# Altium schematic sheet warship_demo_4.SchDoc
size A4
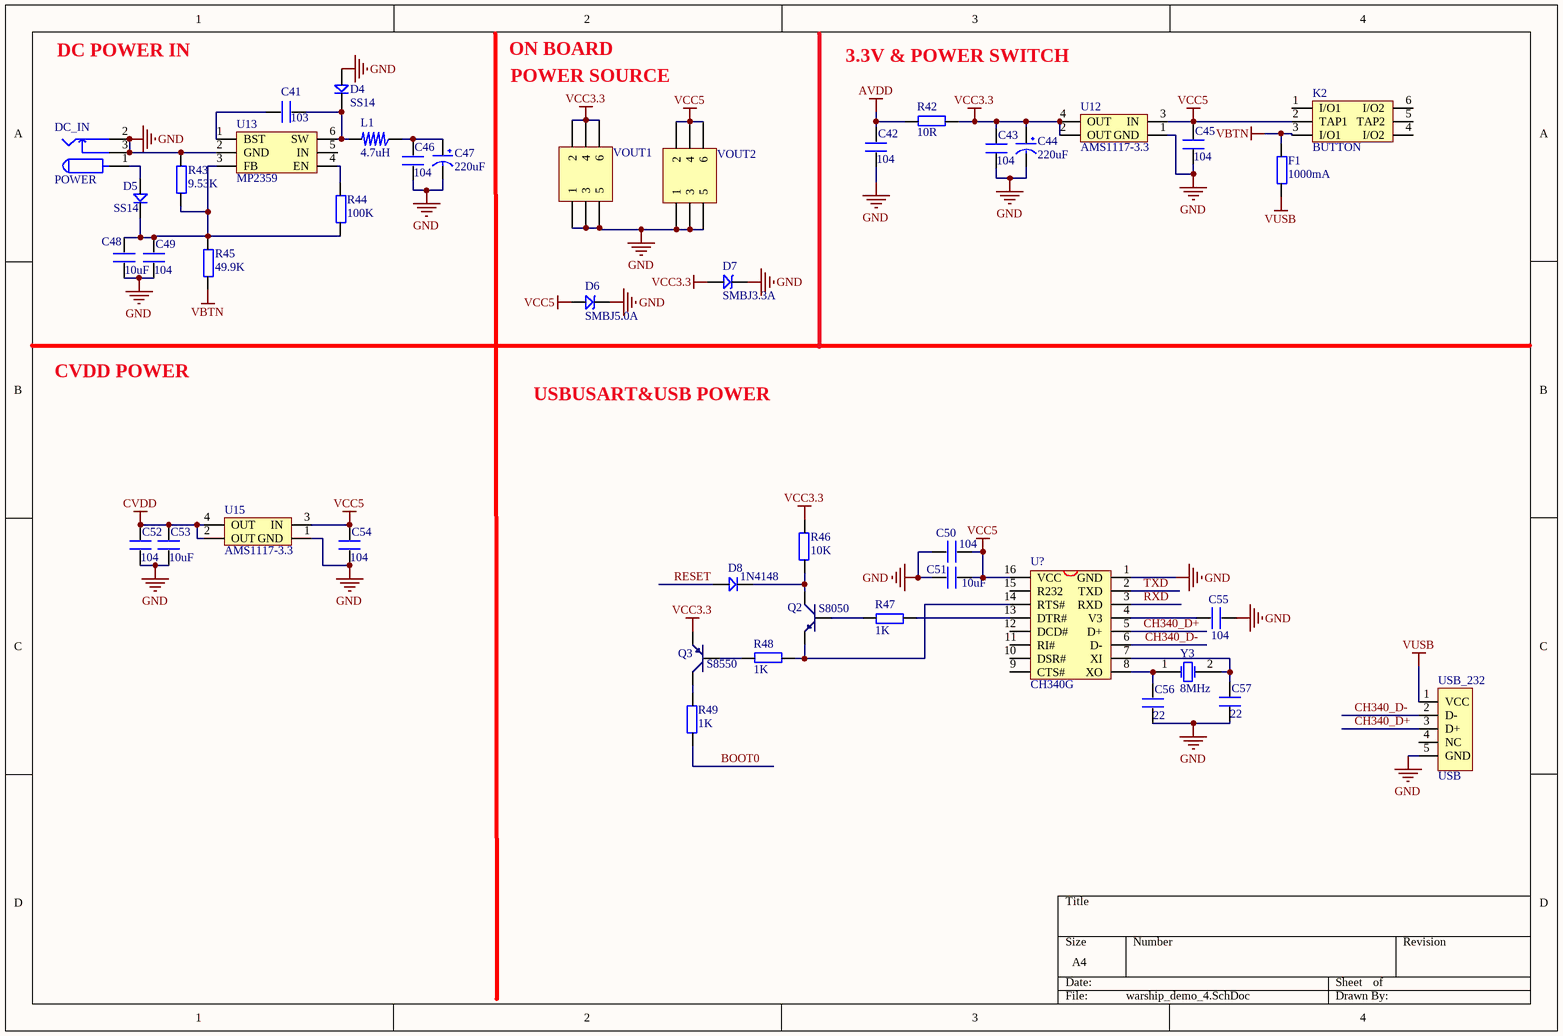
[diagram p0: warship_demo_4.SchDoc]

## Parts
C41  103  [0603P]
C42  104  [0603P]
C43  104  [0603P]
C44  220uF  [CC6.56.5]
C45  104  [0603P]
C46  104  [0603P]
C47  220uF  [CC6.56.5]
C48  10uF  [0603P]
C49  104  [0603P]
C50  104  [0603P]
C51  10uF  [0603P]
C52  104  [0603P]
C53  10uF  [0603P]
C54  104  [0603P]
C55  104  [0603P]
C56  22  [0603P]
C57  22  [0603P]
D4  SS14  [DIODE_SOP]
D5  SS14  [DIODE_SOP]
D6  SMBJ5.0A  [SMBJ]
D7  SMBJ3.3A  [SMBJ]
D8  1N4148  [DIODE_SOP]
DC_IN  POWER  [DC10B]
F1  1000mA  [0603P]
K2  BUTTON  [BTN8.5*8.5]
L1  4.7uH  [L_SOP74]
Q2  S8050  [SOT-23R]
Q3  S8550  [SOT-23R]
R42  10R  [0603P]
R43  9.53K  [0603P]
R44  100K  [0603P]
R45  49.9K  [0603P]
R46  10K  [0603P]
R47  1K  [0603P]
R48  1K  [0603P]
R49  1K  [0603P]
U12  AMS1117-3.3  [AMS1117]
U13  MP2359  [SOT-23-6]
U15  AMS1117-3.3  [AMS1117]
U?  CH340G  [SOP16M]
USB_232  USB  [USB/SM0.8-6H5]
VOUT1  Header 3X2  [HDR2X3]  (value not drawn)
VOUT2  Header 3X2  [HDR2X3]  (value not drawn)
Y3  8MHz  [XTAL_US]

## Nets
AVDD: C42.2 R42.2
CVDD: C52.2 C53.2 U15.2(OUT) U15.4(OUT)
GND: C42.1 C43.1 C44.2(GND) C45.1 C46.1 C47.2(GND) C48.1 C49.1 C50.2 C51.1 C52.1 C53.1 C54.1 C55.1 C56.1 C57.1 D4.1 D6.2 D7.2 DC_IN.2 DC_IN.3 R43.2 U12.1(GND) U13.2(GND) U15.1(GND) U?.1(GND) USB_232.5(GND) VOUT1.1 VOUT1.3 VOUT1.5 VOUT2.1 VOUT2.3 VOUT2.5
VBTN: F1.2 K2.3(I/O1) R45.1
VCC3.3: C43.2 C44.1(VCC) D7.1 Q3.1(E) R42.1 R46.1 U12.2(OUT) U12.4(OUT) VOUT1.2 VOUT1.4 VOUT1.6
VCC5: C45.2 C50.1 C51.2 C54.2 K2.2(TAP1) U12.3(IN) U15.3(IN) U?.16(VCC) VOUT2.2 VOUT2.4 VOUT2.6
VUSB: F1.1 USB_232.1(VCC)
BOOT0: R49.2
CH340_D+: U?.5(D+) USB_232.3(D+)
CH340_D-: U?.6(D-) USB_232.2(D-)
RESET: D8.1
RXD: U?.3(RXD)
TXD: U?.2(TXD)
NetC41_1: C41.1 D4.2 L1.2 U13.6(SW)
NetC41_2: C41.2 U13.1(BST)
NetC46_2: C46.2 C47.1(VCC) L1.1
NetC48_2: C48.2 C49.2 D5.2 R43.1 R44.1 R45.2 U13.3(FB)
NetC55_2: C55.2 U?.4(V3)
NetC56_2: C56.2 U?.8(XO) Y3.1(OSC1)
NetC57_2: C57.2 U?.7(XI) Y3.2(OSC2)
NetD5_1: D5.1 DC_IN.1
NetD8_2: D8.2 Q2.3(C) R46.2
NetQ2_1: Q2.1(E) R48.1 U?.14(RTS#)
NetQ2_2: Q2.2(B) R47.1
NetQ3_2: Q3.2(B) R48.2
NetQ3_3: Q3.3(C) R49.1
NetR44_2: R44.2 U13.4(EN)
NetR47_2: R47.2 U?.13(DTR#)

Not connected (* = marked no-connect by the designer): D6 1; K2 1(I/O1) 4(I/O2) 5(TAP2) 6(I/O2); U13 5(IN); U? 9(CTS#) 10(DSR#) 11(RI#) 12(DCD#) 15(R232); USB_232 4(NC)

## Notes on the sheet
- DC POWER IN
- ON BOARD
- POWER SOURCE
- 3.3V & POWER SWITCH
- CVDD POWER
- USBUSART&USB POWER
- Labels drawn without touching a wire or pin: VCC5

## Library data of the parts
C41-C43 C45 C46 C48-C57 = C
C44 C47 = CAP
D4 D5 D8 = D
D6 D7 = SMBJ: TVS
DC_IN = POW
F1 R42-R49 = R
L1 = L_SOP
Q2 = NPN: 8050/BCW846/BCW847
Q3 = PNP: 8550/BCW68
U12 U15 = AMS1117
U13 = MP2359: DC DC Step Down IC
U? = CH340G: USB2UART
USB_232 = USB5
VOUT1 VOUT2 = Header 3X2: Header, 3-Pin, Dual row; LatestRevisionDate: 17-Jul-2002; LatestRevisionNote: Re-released for DXP Platform.; Publisher: Altium Limited
Y3 = XTAL: Crystal Oscillator; Published: 8-Jun-2000; LatestRevisionDate: 17-Jul-2002; LatestRevisionNote: Re-released for DXP Platform.; Publisher: Altium Limited